# EAGLE design EnvironmentMonitorV2 (EAGLE 7.4.0)
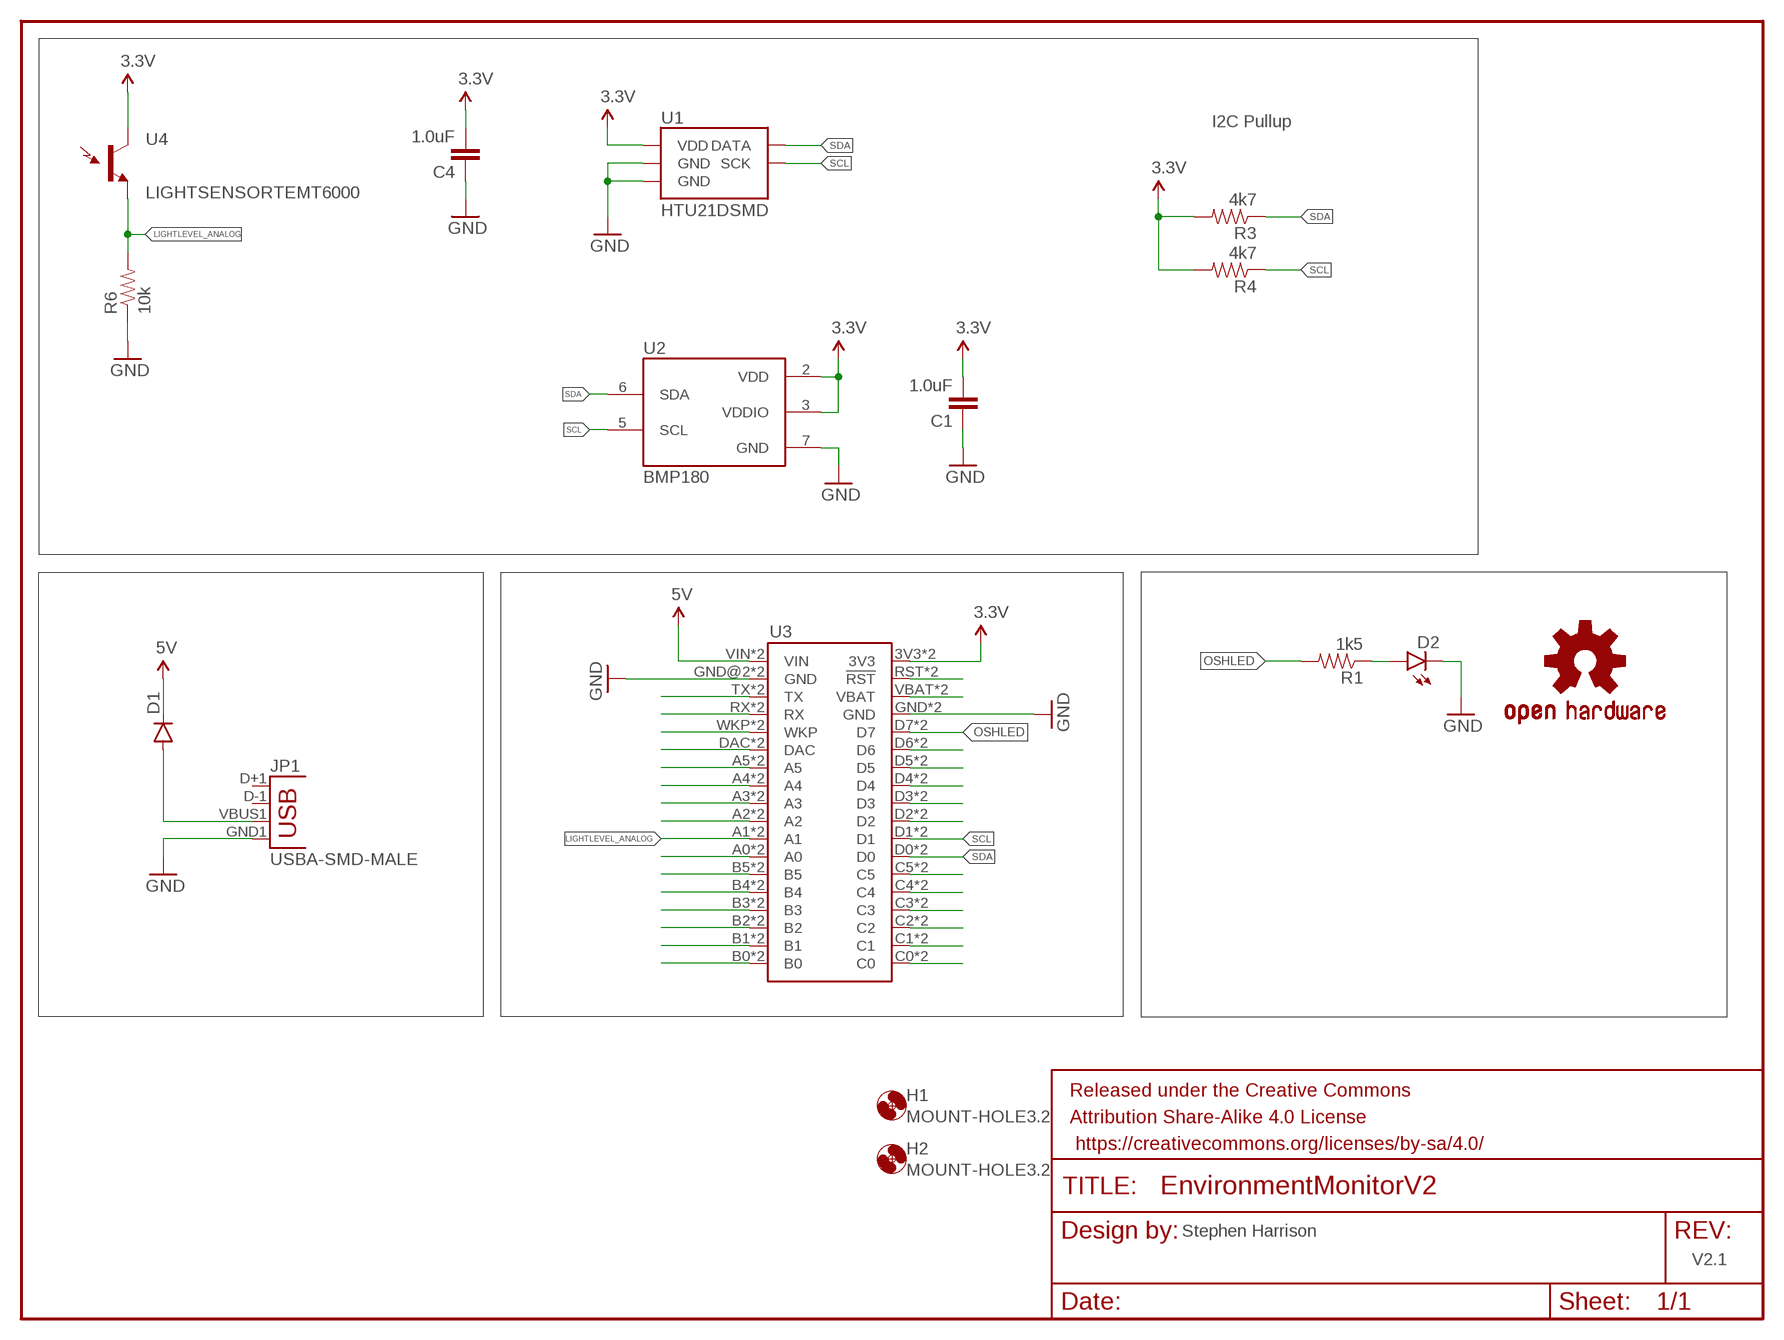
[diagram p0: schematic, sheet 1]

## Parts
C1  1.0uF  1.0UF-25V-+80/-20(0805)"  [0805-CAP]
C4  1.0uF  1.0UF-25V-+80/-20(0805)"  [0805-CAP]
D1  DIODESMA  [SMA-DIODE]
D2  LED1206-BOTTOM  [LED-1206-BOTTOM]
FRAME1  FRAME-LETTER  [CREATIVE_COMMONS]
H1  MOUNT-HOLE3.2  [3,2]
H2  MOUNT-HOLE3.2  [3,2]
JP1  USBA-SMD-MALE  [USB-A-SMT-MALE]
LOGO1  OSHW-LOGOM  [OSHW-LOGO-M]
R1  1k5  RESISTOR0805-RES  [0805]
R3  4k7  RESISTOR0805-RES  [0805]
R4  4k7  RESISTOR0805-RES  [0805]
R6  10k  RESISTOR0805-RES  [0805]
U1  HTU21DSMD  [HTU21D]
U2  BMP180  [BMP180]
U3  ELECTRONDUALNAMED  [ELECTRON_SIMPLE_SILK_NAMES_DUAL]
U4  LIGHTSENSORTEMT6000  [TEMT6000-SEN]

## Nets
1WIRE-DQ: U3.D5 U3.D5_1(D5)
3.3V: C1.2 C4.2 R3.2 R4.2 U1.VDD U2.2(VDD) U2.3(VDDIO) U3.3V3 U3.3V3_1(3V3) U4.COLLECTOR(C1)
5V: D1.C U3.VIN U3.VIN_1B(VIN)
EXTERNAL_INT: U3.D4 U3.D4_1(D4)
GND: C1.1 C4.1 D2.C JP1.GND1(GND) R6.1 U1.7(GND) U1.GND U2.7(GND) U3.GND U3.GND@2(GND) U3.GND_1(GND) U3.GND_1B(GND)
INT: U3.D3 U3.D3_1(D3)
LIGHTLEVEL_ANALOG: R6.2 U3.A1 U3.A1_1(A1) U4.EMITTER(E1)
N$1: U3.RST(!RST) U3.RST_1(!RST)
N$2: U3.VBAT U3.VBATT_1(VBAT)
N$4: U3.D6 U3.D6_1(D6)
N$5: D1.A JP1.VBUS1(VBUS)
N$6: D2.A R1.1
N$8: U3.D2 U3.D2_1(D2)
N$11: U3.C5 U3.C5_1(C5)
N$12: U3.C4 U3.C4_1(C4)
N$13: U3.C3 U3.C3_1(C3)
N$14: U3.C2 U3.C2_1(C2)
N$15: U3.C1 U3.C1_1(C1)
N$16: U3.C0 U3.C0_1(C0)
N$17: U3.B0 U3.B0_1(B0)
N$18: U3.B1 U3.B1_1(B1)
N$19: U3.B2 U3.B2_1(B2)
N$20: U3.B3 U3.B3_1(B3)
N$21: U3.B4 U3.B4_1(B4)
N$22: U3.B5 U3.B5_1(B5)
N$25: U3.A2 U3.A2_1(A2)
N$26: U3.A3 U3.A3_1(A3)
N$27: U3.A4 U3.A4_1(A4)
N$28: U3.A5 U3.A5_1(A5)
N$29: U3.DAC U3.DAC_1(DAC)
N$30: U3.WKP U3.WKP_1(WKP)
N$31: U3.RX U3.RX_1(RX)
N$32: U3.TX U3.TX_1(TX)
OSHLED: R1.2 U3.D7 U3.D7_1(D7)
SCL: R4.1 U1.SCK U2.5(SCL) U3.D1 U3.D1_1(D1)
SDA: R3.1 U1.DATA U2.6(SDA) U3.D0 U3.D0_1(D0)
UV_LEVEL: U3.A0 U3.A0_1(A0)
Unconnected: JP1.D+1(D+) JP1.D-1(D-)

## Notes on the sheet
- I2C Pullup
- Stephen Harrison
- V2.1

## Library data of the parts
C1 C4 = SparkFun-Capacitors:1.0UF-25V-+80/-20(0805): CAP-11625; PROD_ID: CAP-11625
D1 = SparkFun-DiscreteSemi:DIODE: Diode These are standard reverse protection diodes and small signal diodes. SMA package can handle up to about 1A. SOD-323 can handle about 200mA. What the SOD-323 package when ordering, there are some mfgs out there that are 5-pin packages.
D2 = SparkFun-LED:LED: LEDs Standard schematic elements and footprints for 5mm, 3mm, 1206, and 0603 sized LEDs. 5mm - Spark Fun Electronics SKU : COM-00529 (and others)
FRAME1 = SparkFun-Aesthetics:FRAME-LETTER: Schematic Frame Standard 8.5x11 US Letter frame
H1 H2 = holes:MOUNT-HOLE: MOUNTING HOLE with drill center marker
JP1 = Tinamous:USB: USB Connectors USB-B-PTH is fully proven SKU : PRT-00139/CONN-08278 USB-miniB is fully proven SKU : PRT-00587 USB-A-PCB is untested. USB-A-H is throughly reviewed, but untested. Spark Fun Electronics SKU : PRT-00437 USB-B-SMT is throughly reviewed, but untested. Needs silkscreen touching up. USB-A-S has not been used/tested USB-MB-H has not been used/tested USB-MICROB has been used. CONN-09505
LOGO1 = SparkFun-Aesthetics:OSHW-LOGO: Open Source Hardware Logo This logo indicates the piece of hardware it is found on incorporates a OSHW license and/or adheres to the definition of open source hardware found here: http://freedomdefined.org/OSHW
R1 R3 R4 R6 = SparkFun-Resistors:RESISTOR: Resistor Basic schematic elements and footprints for 0603, 1206, and PTH resistors.
U1 = SparkFun-Sensors:HTU21D; PROD_ID: IC-11793
U2 = SparkFun-Sensors:BMP180: BOSCH BMP180 DIGITAL BAROMETRIC PRESSURE SENSOR Web page: http://www.bosch-sensortec.com/en/homepage/products_3/environmental_sensors_1/bmp180_1/bmp180 Datasheet: http://ae-bst.resource.bosch.com/media/products/dokumente/bmp180/BST-BMP180-DS000-09.pdf The BMP180 is the function compatible successor of the BMP085, a new generation of high precision digital pressure sensors for consumer applications. The ultra-low power, low voltage electronics of the BMP180 is optimized for use in mobile phones, PDAs, GPS navigation devices and outdoor equipment. With a low altitude noise of merely 0.25m at fast conversion time, the BMP180 offers superior performance. The I2C interface allows for easy system integration with a microcontroller. The BMP180 is based on piezo-resistive technology for EMC robustness, high accuracy and linearity as well as long term stability. Key features: - Temperature measurement included - I2C interface - Fully calibrated - Pb-free, halogen-free and RoHS compliant, - MSL 1 Basic specs: Pressure range: 300 to 1100hPa (+9000m to -500m relating to sea level) Supply voltage: 1.8 to 3.6V (VDD), 1.62V to 3.6V (VDDIO) Package: LGA package with metal lid Small footprint: 3.6mm x 3.8mm Super-flat: 0.93mm height Low power: 5μA at 1 sample / sec. in standard mode Low noise: 0.06hPa (0.5m) in ultra low power mode, 0.02hPa (0.17m) advanced resolution mode Typical applications: - Enhancement of GPS navigation (dead-reckoning, slope detection, etc.) - In- and out-door navigation - Leisure and sports - Weather forecast - Vertical velocity indication (rise/sink speed)
U3 = Tinamous:ELECTRON
U4 = SparkFun-Sensors:LIGHTSENSOR: Ambient Light Sensor Simple light detection sensor. Output varies with light intensity input. Spark Fun Electronics SKU : COM-08348

## Board
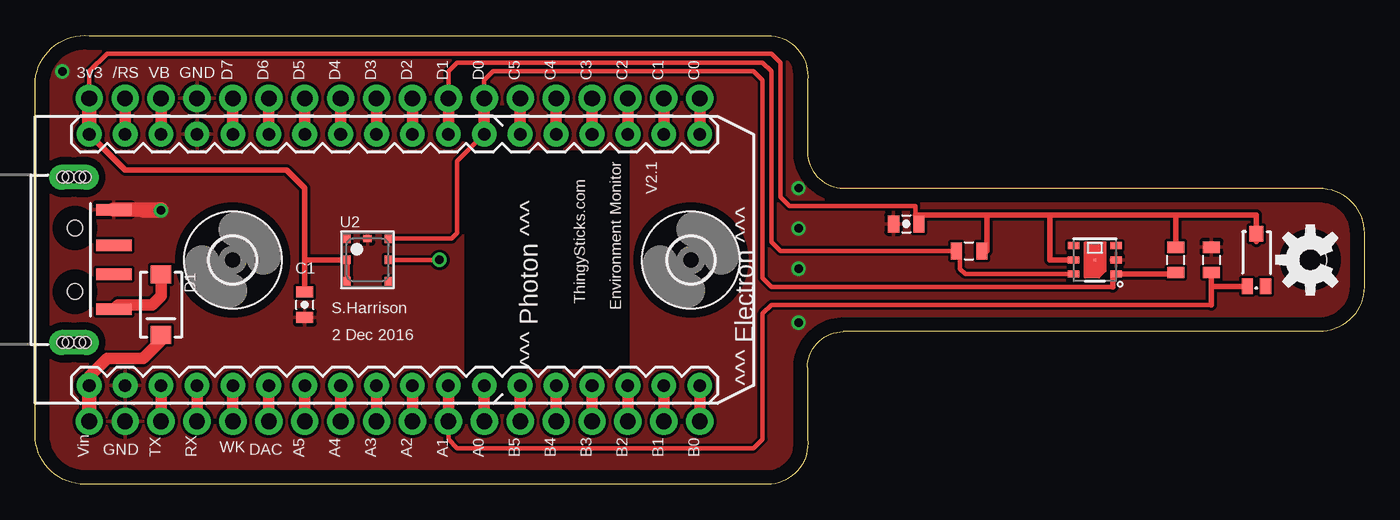
[diagram p1: board, top side]
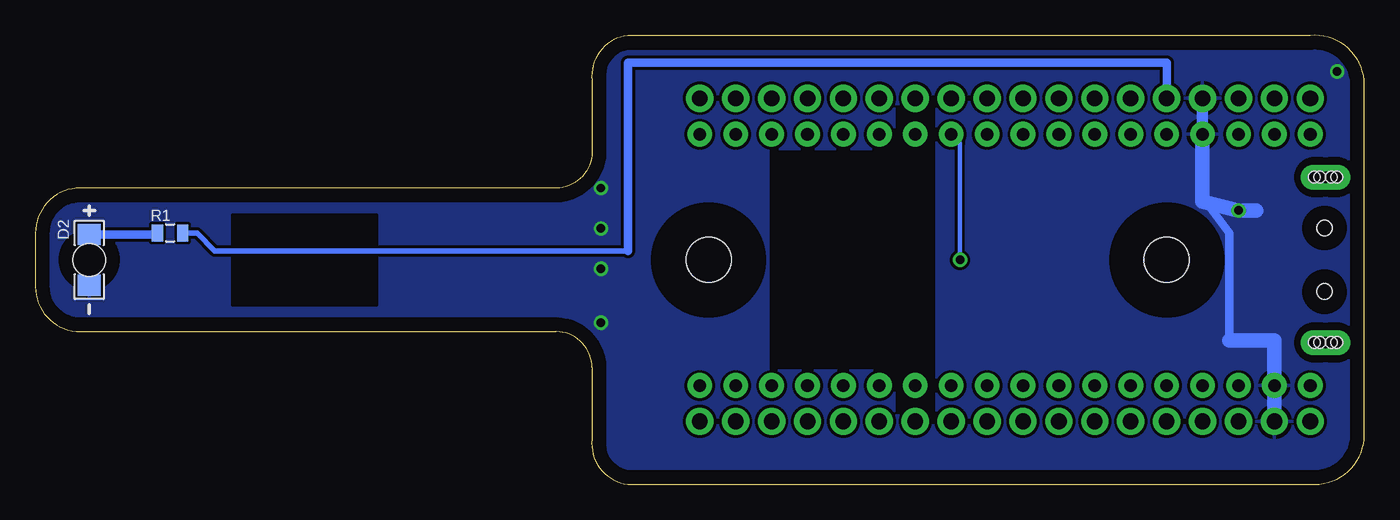
[diagram p2: board, bottom side, seen from below]

Size 93.98 x 31.78 mm. Coordinates in mm from the lower left corner, seen from the top.
Outline: 0,3.19 0,28.59 arc-90 3.81,31.76 52.07,31.76 arc-90 54.61,28.59 54.61,23.51 arc90 57.15,20.97 90.81,20.97 arc-90 93.98,17.79 93.98,13.98 arc-90 90.81,10.81 57.15,10.81 arc90 54.61,8.27 54.61,3.19 arc-90 52.07,0.01 3.81,0.01 arc-90 0,3.19
Copper layers (1*16): Top 0.035mm / dielectric 1.5mm / Bottom 0.035mm
Design rules "default": minimum track width 10mil, minimum drill 24mil, track to track 8mil, track to pad 8mil, pad to pad 8mil, via to via 8mil, smd to smd 8mil, copper to edge 40mil, drill to drill 8mil, minimum pad ring 10mil, minimum via ring 8mil, stop-mask expansion 4mil, vias tented up to drill 0mil, thermal gap 10mil
tRestrict: area 30.5,5.1 to 41.9,26.7
bRestrict: area 30.5,5.1 to 41.9,26.7; area 69.8,12.7 to 80,19.1

### Footprints (pad centres in the part's own frame; a part is rotated, then mirrored left to right if it is on the bottom)
0805-CAP = smd 0.8 x 1.2: 1 -0.9,0; 2 0.9,0
SMA-DIODE = smd 1.27 x 1.47: A -2.15,0; C 2.15,0
LED-1206-BOTTOM = smd 1.5 x 1.6: A -1.8,0; C 1.8,0 | hole 2.3: 0,0
3,2 = hole 3.2: 0,0
USB-A-SMT-MALE = smd 0.8 x 2.5: D+1 1.027,-5.87; D-1 -1.027,-5.87; GND1 3.551,-5.87; VBUS1 -3.5,-5.87 | drill 0.8 pad 1.778 long: P$1 5.85,-3.05; P$3 -5.85,-3.05 | hole 1.1: 2.25,-3.12; -2.25,-3.12 | hole 0.8: -5.85,-3.45; -5.85,-3.85; -5.85,-2.65; -5.85,-2.25; 5.85,-3.45; 5.85,-3.85; 5.85,-2.65; 5.85,-2.25
0805 = smd 0.8 x 1.2: 1 -0.9,0; 2 0.9,0
HTU21D = smd 0.2 x 0.2: 7 0,0 | smd 0.8 x 0.5: DATA 1.5,-1; GND 1.5,0; NC@1 -1.5,1; NC@6 1.5,1; SCK -1.5,-1; VDD -1.5,0
BMP180 = smd 0.6 x 0.5: 1 1.5,1.45; 2 0,1.45; 3 -1.5,1.45; 4 -1.5,-1.45; 5 0,-1.45; 6 1.5,-1.45 | smd 0.5 x 0.6: 7 1.5,0
ELECTRON_SIMPLE_SILK_NAMES_DUAL = drill 0.889 pad 1.753: 3V3 1.27,22.86; A0 29.21,5.08; A1 26.67,5.08; A2 24.13,5.08; A3 21.59,5.08; A4 19.05,5.08; A5 16.51,5.08; B0 44.45,5.08; B1 41.91,5.08; B2 39.37,5.08; B3 36.83,5.08; B4 34.29,5.08; B5 31.75,5.08; C0 44.45,22.86; C1 41.91,22.86; C2 39.37,22.86; C3 36.83,22.86; C4 34.29,22.86; C5 31.75,22.86; D0 29.21,22.86; D1 26.67,22.86; D2 24.13,22.86; D3 21.59,22.86; D4 19.05,22.86; D5 16.51,22.86; D6 13.97,22.86; D7 11.43,22.86; DAC 13.97,5.08; GND 8.89,22.86; GND@2 3.81,5.08; RST 3.81,22.86; RX 8.89,5.08; TX 6.35,5.08; VBAT 6.35,22.86; VIN 1.27,5.08; WKP 11.43,5.08 | drill 1.1 pad 1.93: 3V3_1 1.27,25.4; A0_1 29.21,2.54; A1_1 26.67,2.54; A2_1 24.13,2.54; A3_1 21.59,2.54; A4_1 19.05,2.54; A5_1 16.51,2.54; B0_1 44.45,2.54; B1_1 41.91,2.54; B2_1 39.37,2.54; B3_1 36.83,2.54; B4_1 34.29,2.54; B5_1 31.75,2.54; C0_1 44.45,25.4; C1_1 41.91,25.4; C2_1 39.37,25.4; C3_1 36.83,25.4; C4_1 34.29,25.4; C5_1 31.75,25.4; D0_1 29.21,25.4; D1_1 26.67,25.4; D2_1 24.13,25.4; D3_1 21.59,25.4; D4_1 19.05,25.4; D5_1 16.51,25.4; D6_1 13.97,25.4; D7_1 11.43,25.4; DAC_1 13.97,2.54; GND_1 8.89,25.4; GND_1B 3.81,2.54; RST_1 3.81,25.4; RX_1 8.89,2.54; TX_1 6.35,2.54; VBATT_1 6.35,25.4; VIN_1B 1.27,2.54; WKP_1 11.43,2.54
TEMT6000-SEN = smd 1.1 x 0.8: BASE -1.87,-0.65; EMITTER -1.87,0.65 | smd 1.1 x 1: COLLECTOR 1.86,0.01

### Placement (x,y rotation side)
C1  19.05,12.71 90 top
C4  61.59,18.43 0 top
D1  8.89,12.71 270 top
D2  90.17,15.89 270 bottom
FRAME1  1.27,-17.13 0 top  (outside the outline)
H1  13.97,15.89 0 top
H2  46.35,15.89 0 top
JP1  -0.32,15.89 90 top
LOGO1  90.17,15.89 90 top
R1  84.45,17.79 0 bottom
R3  80.64,15.89 90 top
R4  66.04,16.52 0 top
R6  83.19,15.89 270 top
U1  74.93,15.89 0 top
U2  23.5,15.89 90 top
U3  2.54,1.92 0 top
U4  86.36,15.89 90 top

### Tracks (layer width: path | path; a pad name or v marks a point on that pad's centre or on a via)
1WIRE-DQ
  Top 0.813: U3.D5_1 U3.D5
3.3V
  Top 0.305: C4.2 62.23,18.43 62.23,19.06 62.23,19.7 53.34,19.7 52.7,20.33 52.7,29.86 52.07,30.49 5.08,30.49 3.81,29.22 U3.3V3_1
  Top 0.406: U4.COLLECTOR 86.36,17.17 86.36,19.06 80.64,19.06 | 80.64,19.06 R3.2 | U1.VDD 71.75,15.89 71.75,19.06 | R4.2 67.31,16.52 67.31,19.06 | 19.05,15.89 U2.2 U2.3 | U3.3V3 6.35,22.24 17.78,22.24 19.05,20.97 19.05,15.89 | C1.2 19.05,15.89 | 80.64,19.06 71.75,19.06 | 71.75,19.06 67.31,19.06 | 67.31,19.06 62.23,19.06
  Top 1.016: U3.3V3 U3.3V3_1
5V
  Top 0.813: U3.VIN 3.81,7.63 5.08,8.9 7.62,8.9 8.89,10.17 D1.C
  Top 1.016: U3.VIN_1B U3.VIN
EXTERNAL_INT
  Top 0.813: U3.D4 U3.D4_1
GND  (via drill 0.6)
  Top 1.016: JP1.GND1 8.89,19.44 v8.89,19.38 7.62,19.38
  Bottom 0.61: U3.GND 11.43,20.33 9.53,17.79 9.53,10.17
  Bottom 0.813: U3.GND_1 U3.GND
  Bottom 1.016: U3.GND 11.43,20.02 v8.89,19.38 7.62,19.38 | 9.53,10.17 6.35,10.17 U3.GND@2 U3.GND_1B
  other vias: 53.98,18.11 53.98,15.25 53.98,20.97 1.91,29.22 53.98,11.44
  pour Bottom: 102.23,32.4 102.23,-0.62 -0.64,-0.62 -0.64,32.4
  pour Top: -0.64,32.4 102.23,31.76 102.23,-1.26 -0.64,-0.62
INT
  Top 0.813: U3.D3 U3.D3_1
LIGHTLEVEL_ANALOG
  Top 0.305: 83.19,12.71 52.07,12.71 51.44,12.08 51.44,3.19 50.8,2.55 29.84,2.55 29.21,3.19 U3.A1_1
  Top 0.406: 83.19,12.71 R6.2 83.19,14.02 U4.EMITTER
  Top 0.813: U3.A1_1 U3.A1
N$1
  Top 0.813: U3.RST U3.RST_1
N$2
  Top 0.813: U3.VBATT_1 U3.VBAT
N$4
  Top 0.813: U3.D6_1 U3.D6
N$5
  Top 0.813: D1.A 8.89,13.35 8.26,12.71 5.88,12.71 JP1.VBUS1
N$6
  Bottom 0.61: D2.A 85.36,17.69 R1.1
N$8
  Top 0.813: U3.D2_1 U3.D2
N$11
  Top 0.813: U3.C5 U3.C5_1
N$12
  Top 0.813: U3.C4_1 U3.C4
N$13
  Top 0.813: U3.C3 U3.C3_1
N$14
  Top 0.813: U3.C2_1 U3.C2
N$15
  Top 0.813: U3.C1 U3.C1_1
N$16
  Top 0.813: U3.C0_1 U3.C0
N$17
  Top 0.813: U3.B0 U3.B0_1
N$18
  Top 0.813: U3.B1_1 U3.B1
N$19
  Top 0.813: U3.B2 U3.B2_1
N$20
  Top 0.813: U3.B3_1 U3.B3
N$21
  Top 0.813: U3.B4 U3.B4_1
N$22
  Top 0.813: U3.B5_1 U3.B5
N$25
  Top 0.813: U3.A2 U3.A2_1
N$26
  Top 0.813: U3.A3_1 U3.A3
N$27
  Top 0.813: U3.A4 U3.A4_1
N$28
  Top 0.813: U3.A5 U3.A5_1
N$29
  Top 0.813: U3.DAC U3.DAC_1
N$30
  Top 0.813: U3.WKP U3.WKP_1
N$31
  Top 0.813: U3.RX U3.RX_1
N$32
  Top 0.813: U3.TX U3.TX_1
OSHLED
  Top 0.813: U3.D7_1 U3.D7
  Bottom 0.406: R1.2 82.55,17.79 81.28,16.52 52.07,16.52
  Bottom 0.61: 52.07,16.52 52.07,29.86 13.97,29.86 U3.D7_1
SCL  (via drill 0.6)
  Top 0.305: U2.5 v28.57,15.89 | U3.D1_1 29.21,29.22 29.84,29.86 51.44,29.86 52.07,29.22 52.07,17.16 52.7,16.52 R4.1 65.41,16.26 65.41,15.25 65.77,14.89 U1.SCK
  Top 0.813: U3.D1 U3.D1_1
  Bottom 0.305: v28.57,15.89 28.57,24.14 U3.D1
SDA
  Top 0.305: 76.2,13.98 52.07,13.98 51.44,14.62 51.44,28.59 50.8,29.22 32.38,29.22 31.75,28.59 U3.D0_1 | U2.6 29.44,17.39 29.84,17.79 29.84,22.87 U3.D0
  Top 0.406: R3.1 80.64,14.89 U1.DATA 76.2,14.89 76.2,13.98
  Top 0.813: U3.D0_1 U3.D0
UV_LEVEL
  Top 0.813: U3.A0 U3.A0_1

### Text on the board
tNames: Environment Monitor | V2.1 | ThingySticks.com | S.Harrison | 2 Dec 2016 | ^^^ Photon ^^^ | ^^^ Electron ^^^